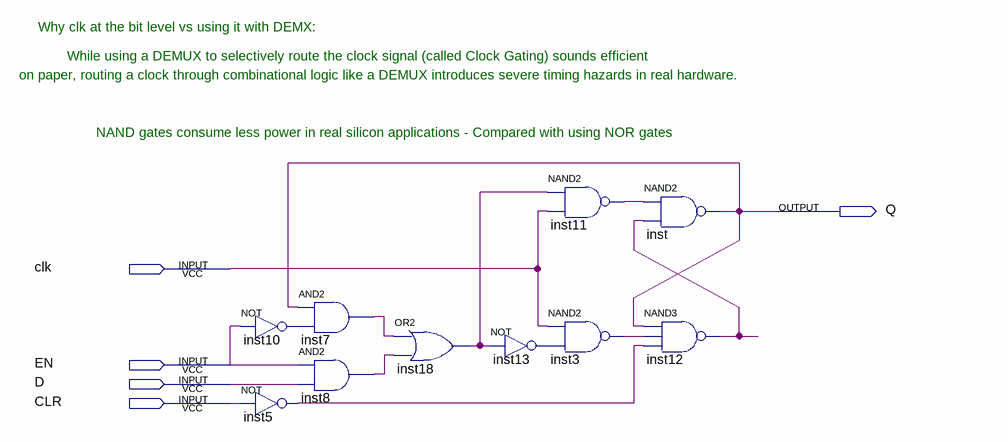
[diagram p0: schematic sheet]
// Quartus schematic BitRegister.bdf as structural Verilog: 10 symbols, 5 pins
module BitRegister (
  input  clk,
  input  EN,
  input  D,
  input  CLR,
  output Q
);

  wire inst3_out, inst5_out, inst7_out, inst8_out, inst10_out, inst11_out, inst12_out, inst13_out, inst18_out;

  not inst10 (inst10_out, EN);
  not inst5 (inst5_out, CLR);
  and inst7 (inst7_out, Q, inst10_out);
  and inst8 (inst8_out, EN, D);
  or inst18 (inst18_out, inst7_out, inst8_out);
  nand inst11 (inst11_out, inst18_out, clk);
  nand inst3 (inst3_out, clk, inst13_out);
  not inst13 (inst13_out, inst18_out);
  nand inst (Q, inst11_out, inst12_out);
  nand inst12 (inst12_out, Q, inst3_out, inst5_out);

  // Notes on the sheet:
  //   Why clk at the bit level vs using it with DEMX:
  //   While using a DEMUX to selectively route the clock signal (called Clock Gating) sounds efficient 
  //   on paper, routing a clock through combinational logic like a DEMUX introduces severe timing hazards in real hardware.
  //   NAND gates consume less power in real silicon applications - Compared with using NOR gates
endmodule
